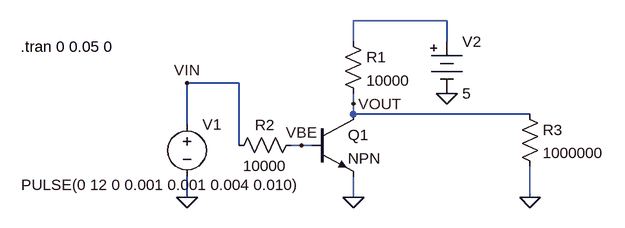
[diagram p0: schematic Trans-sw.asc]
Trans-sw.asc, the LTspice schematic file:
Version 4
SHEET 1 880 680
WIRE 384 16 240 16
WIRE 240 48 240 16
WIRE 384 48 384 16
WIRE 64 112 -16 112
WIRE 240 144 240 128
WIRE 240 160 240 144
WIRE 512 160 240 160
WIRE -16 176 -16 112
WIRE 64 208 64 112
WIRE 160 208 144 208
WIRE 176 208 160 208
WIRE -16 288 -16 256
WIRE 240 288 240 256
WIRE 512 288 512 240
FLAG 240 288 0
FLAG -16 288 0
FLAG -16 112 VIN
FLAG 240 144 VOUT
FLAG 512 288 0
FLAG 384 128 0
FLAG 160 208 VBE
SYMBOL voltage -16 160 R0
WINDOW 123 0 0 Left 2
WINDOW 39 0 0 Left 2
WINDOW 3 -255 109 Left 2
SYMATTR InstName V1
SYMATTR Value PULSE(0 12 0 0.001 0.001 0.004 0.010)
SYMBOL npn 176 160 R0
SYMATTR InstName Q1
SYMBOL res 224 32 R0
SYMATTR InstName R1
SYMATTR Value 10000
SYMBOL res 160 192 R90
WINDOW 0 0 56 VBottom 2
WINDOW 3 32 56 VTop 2
SYMATTR InstName R2
SYMATTR Value 10000
SYMBOL Misc\\battery 384 32 R0
WINDOW 123 0 0 Left 2
WINDOW 39 0 0 Left 2
SYMATTR InstName V2
SYMATTR Value 5
SYMBOL res 496 144 R0
SYMATTR InstName R3
SYMATTR Value 1000000
TEXT -272 56 Left 2 !.tran 0 0.05 0

The netlist it stands for:
* Trans-sw.asc
V1 VIN 0 PULSE(0 12 0 0.001 0.001 0.004 0.010)
Q1 VOUT VBE 0 0 NPN
R1 N001 VOUT 10000
R2 VBE VIN 10000
V2 N001 0 5
R3 VOUT 0 1000000
.model NPN NPN
.model PNP PNP
.lib standard.bjt
.tran 0 0.05 0
.backanno
.end